# Altium schematic sheet Sensing - Temperature.SchDoc: [9] Sensing - Temperature
size A4; ApprovedBy: Nagy Richard; CheckedBy: Nagy Richard; Author: Nagy Richard; CompanyName: EmbedCore; DrawnBy: Nagy Richard; Engineer: Nagy Richard; Organization: EmbedCore; DocumentNumber: 9; Revision: 1.0; SheetNumber: 9; SheetTotal: 15
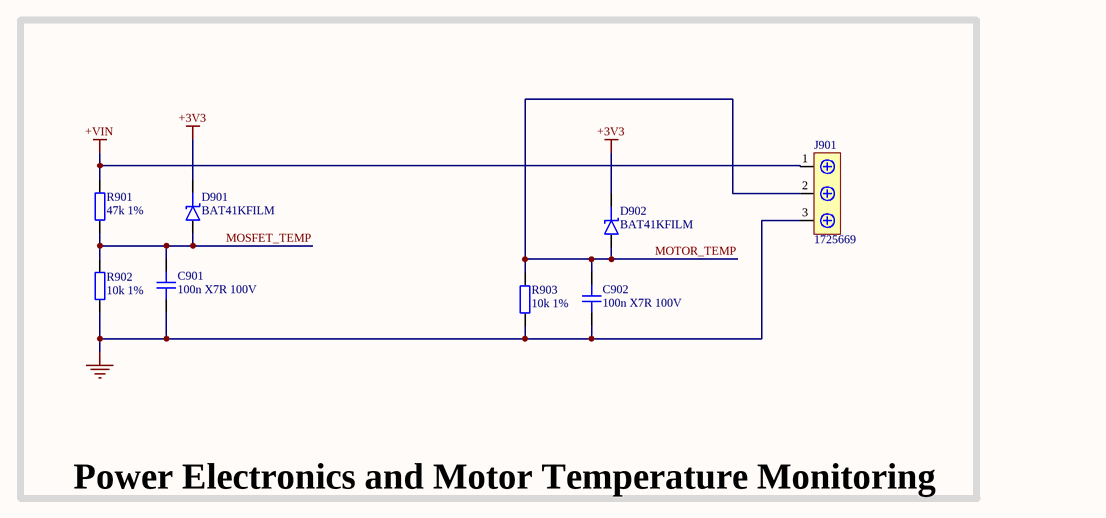
[diagram p0: Sensing - Temperature.SchDoc]

## Parts
C901  100n X7R 100V  [CAP_0603]
C902  100n X7R 100V  [CAP_0603]
D901  BAT41KFILM  [SOD-523]
D902  BAT41KFILM  [SOD-523]
J901  1725669  [1725669]
R901  47k 1%  [RES_0603]
R902  10k 1%  [RES_0603]
R903  10k 1%  [RES_0603]

## Blocks framed on the sheet
Power Electronics and Motor Temperature Monitoring: C901 C902 D901 D902 J901 R901-R903

## Nets
+3V3: D901.K D902.K
+VIN: J901.1 R901.2
GND: C901.1 C902.1 J901.3 R902.1 R903.1
MOSFET_TEMP: C901.2 D901.A R901.1 R902.2
MOTOR_TEMP: C902.2 D902.A J901.2 R903.2

## Notes on the sheet
- Title:
- Drawn By:
- Page Contents:
- Checked By:
- Size:
- Date:
- File:
- License:
- Email:
- A4
- Number:
- Time:
- Revision:
- Sheet
- Website:
- of

## Library data of the parts
C901 C902 = CAP_0603: Capacitor SMD 0603; Manufacturer: CCTC; Manufacturer Part Number: TCC0603X7R104K101CT; Distributor Link: www.lcsc.com; LCSC: C696916; Rating: *; Dielectric: *
D901 D902 = D_SCHOTTKY_SOD_523: Diode Schottky SMD SOD-323; Manufacturer: STMicroelectronics; Manufacturer Part Number: BAT41KFILM; LCSC: C73150
J901 = 1725669: Screw Terminal Block 3 Positions 2.54mm; Manufacturer: Phoenix; Manufacturer Part Number: 1725669; Distributor Link: https://www.mouser.de/ProductDetail/Phoenix-Contact/1725669?qs=A%2FKWGUWTCZjmkTL0Oe91ew%3D%3D
R901 = RES_0603: Resistor SMD 0603; Manufacturer: Vishay Intertech; Manufacturer Part Number: NTCS0603E3473FHT; Distributor Link: www.lcsc.com; LCSC: C511055
R902 R903 = RES_0603: Resistor SMD 0603; Manufacturer: YAGEO; Manufacturer Part Number: RC0603FR-07140KL; Distributor Link: www.lcsc.com; LCSC: C185372